# Altium schematic sheet Sheet1.SchDoc: Network Analyzer
size A
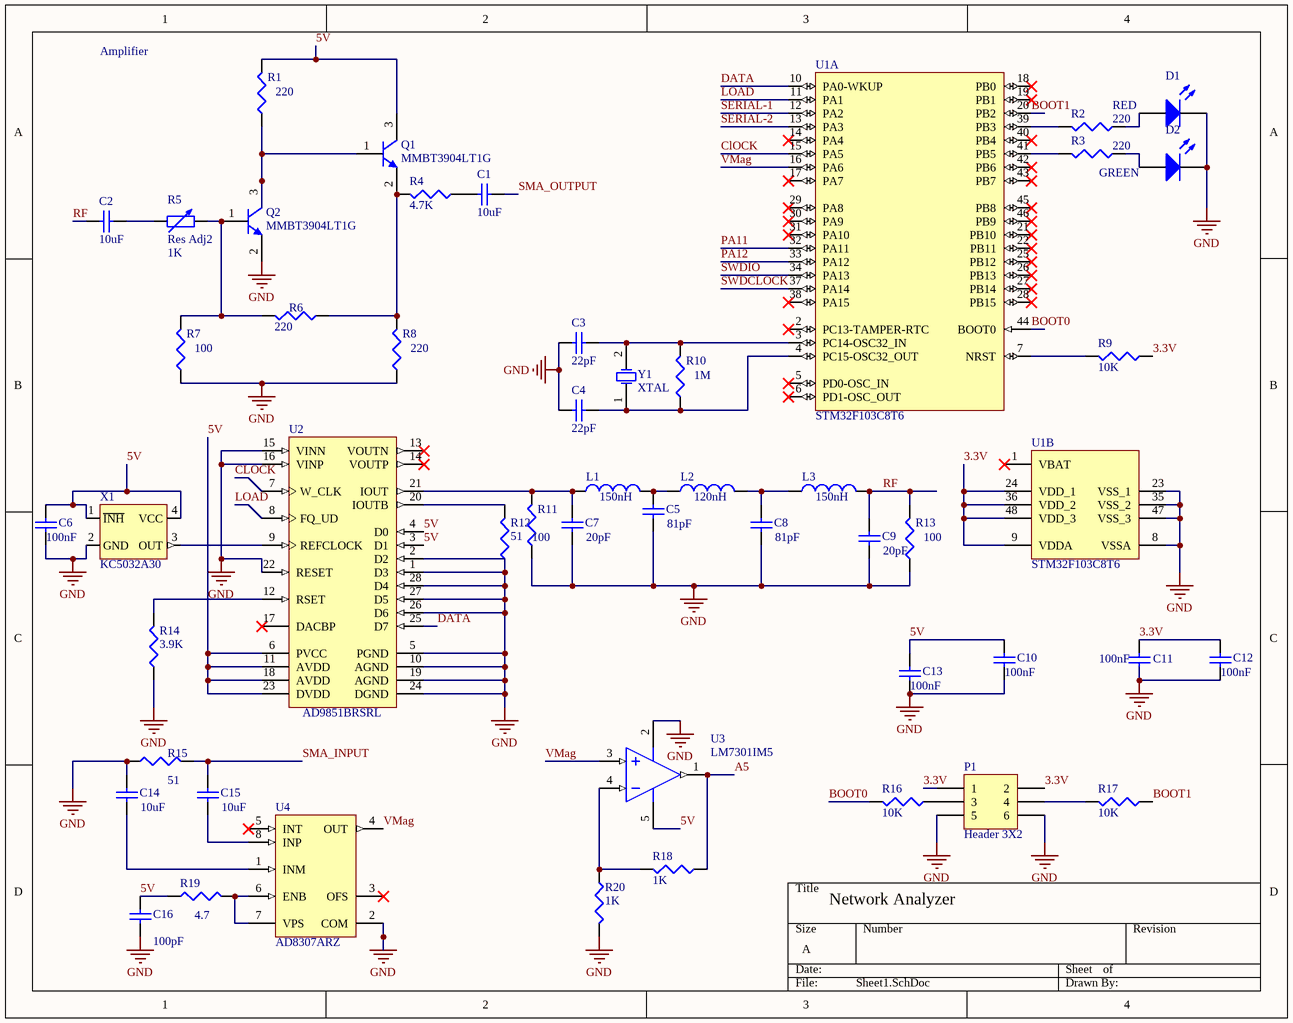
[diagram p0: Sheet1.SchDoc]

## Parts
C1  value 10uF  [CAP 0603/1608]  (hidden comment: Cap Semi)
C2  value 10uF  [CAP 0603/1608]  (hidden comment: Cap Semi)
C3  value 22pF  [CAP 0603/1608]  (hidden comment: Cap Semi)
C4  value 22pF  [CAP 0603/1608]  (hidden comment: Cap Semi)
C5  value 81pF  [CAP 0603/1608]  (hidden comment: Cap Semi)
C6  value 100nF  [CAP 0603/1608]  (hidden comment: Cap Semi)
C7  value 20pF  [CAP 0603/1608]  (hidden comment: Cap Semi)
C8  value 81pF  [CAP 0603/1608]  (hidden comment: Cap Semi)
C9  value 20pF  [CAP 0603/1608]  (hidden comment: Cap Semi)
C10  value 100nF  [1608[0603]]  (hidden comment: Cap Semi)
C11  value 100nF  [1608[0603]]  (hidden comment: Cap Semi)
C12  value 100nF  [1608[0603]]  (hidden comment: Cap Semi)
C13  value 100nF  [1608[0603]]  (hidden comment: Cap Semi)
C14  value 10uF  [1608[0603]]  (hidden comment: Cap Semi)
C15  value 10uF  [1608[0603]]  (hidden comment: Cap Semi)
C16  value 100pF  [1608[0603]]  (hidden comment: Cap Semi)
D1  RED  [LED 0603/1608 RED]
D2  GREEN  [LED 0603/1608 GREEN]
L1  value 150nH  [RES 0805/2012]  (hidden comment: Inductor)
L2  value 120nH  [RES 0603/1608]  (hidden comment: Inductor)
L3  value 150nH  [RES 0805/2012]  (hidden comment: Inductor)
P1  Header 3X2  [HDR2X3]
Q1  MMBT3904LT1G  [ONSC-SOT-23-3-318-08_V]
Q2  MMBT3904LT1G  [ONSC-SOT-23-3-318-08_V]
R1  value 220  [RES 0603/1608]  (hidden comment: Res3)
R2  value 220  [RES 0603/1608]  (hidden comment: Res3)
R3  value 220  [RES 0603/1608]  (hidden comment: Res3)
R4  value 4.7K  [RES 1206/3216]  (hidden comment: Res3)
R5  Res Adj2  value 1K  [POT BOURNS TRIMPOT 3302]
R6  value 220  [RES 0603/1608]  (hidden comment: Res3)
R7  value 100  [RES 0603/1608]  (hidden comment: Res3)
R8  value 220  [RES 0603/1608]  (hidden comment: Res3)
R9  value 10K  [RES 0603/1608]  (hidden comment: Res3)
R10  value 1M  [RES 0603/1608]  (hidden comment: Res3)
R11  value 100  [RES 0603/1608]  (hidden comment: Res3)
R12  value 51  [RES 0603/1608]  (hidden comment: Res3)
R13  value 100  [RES 0603/1608]  (hidden comment: Res3)
R14  value 3.9K  [RES 0603/1608]  (hidden comment: Res3)
R15  value 51  [J1-0603]  (hidden comment: Res3)
R16  value 10K  [J1-0603]  (hidden comment: Res3)
R17  value 10K  [J1-0603]  (hidden comment: Res3)
R18  value 1K  [J1-0603]  (hidden comment: Res3)
R19  value 4.7  [J1-0603]  (hidden comment: Res3)
R20  value 1K  [J1-0603]  (hidden comment: Res3)
U1  STM32F103C8T6  [STM-LQFP48_N]  (parts A,B of 2)
U2  AD9851BRSRL  [ADI-RS-28_M]
U3  LM7301IM5  [MF05A_N]
U4  AD8307ARZ  [ADI-R-8_N]
X1  KC5032A30  [KC5032A30]
Y1  XTAL  [ABRACON ABLS]

## Nets
GND: C3.2 C4.2 C5.1 C6.1 C7.1 C8.1 C9.1 C10.1 C11.1 C12.1 C13.1 C14.2 C16.1 D1.2(K) D2.2(K) P1.5 P1.6 Q2.2(E) R7.1 R8.1 R11.1 R12.1 R13.1 R14.1 R15.1 R20.2 U1.8(VSSA) U1.23(VSS_1) U1.35(VSS_2) U1.47(VSS_3) U2.1(D3) U2.2(D2) U2.5(PGND) U2.10(AGND) U2.15(VINN) U2.16(VINP) U2.19(AGND) U2.22(RESET) U2.24(DGND) U2.26(D6) U2.27(D5) U2.28(D4) U3.2(V-) U4.2(COM) X1.2(GND)
3.3V: C11.2 C12.2 P1.1 P1.2 R9.1 U1.9(VDDA) U1.24(VDD_1) U1.36(VDD_2) U1.48(VDD_3)
5V: C6.2 C10.2 C13.2 C16.2 Q1.3(C) R1.2 R19.1 U2.3(D1) U2.4(D0) U2.6(PVCC) U2.11(AVDD) U2.18(AVDD) U2.23(DVDD) U3.5(V+) X1.1(~{INH}) X1.4(VCC)
A5: R18.1 U3.1(OUT)
BOOT0: R16.2 U1.44(BOOT0)
BOOT1: R17.1 U1.20(PB2)
CLOCK: U1.15(PA5) U2.7(W_CLK)
DATA: U1.10(PA0-WKUP) U2.25(D7)
LOAD: U1.11(PA1) U2.8(FQ_UD)
PA11: U1.32(PA11)
PA12: U1.33(PA12)
RF: C2.2 C9.2 L3.2 R13.2
SERIAL-1: U1.12(PA2)
SERIAL-2: U1.13(PA3)
SMA_INPUT: C15.2 R15.2
SMA_OUTPUT: C1.2
SWDCLOCK: U1.37(PA14)
SWDIO: U1.34(PA13)
VMag: U1.16(PA6) U3.3(IN+) U4.4(OUT)
NetC1_1: C1.1 R4.1
NetC2_1: C2.1 R5.1
NetC3_1: C3.1 R10.2 U1.3(PC14-OSC32_IN) Y1.2(OSC2)
NetC4_1: C4.1 R10.1 U1.4(PC15-OSC32_OUT) Y1.1(OSC1)
NetC5_2: C5.2 L1.2 L2.1
NetC7_2: C7.2 L1.1 R11.2 U2.21(IOUT)
NetC8_2: C8.2 L2.2 L3.1
NetC14_1: C14.1 U4.1(INM)
NetC15_1: C15.1 U4.8(INP)
NetD1_1: D1.1(A) R2.1
NetD2_1: D2.1(A) R3.1
NetP1_3: P1.3 R16.1
NetP1_4: P1.4 R17.2
NetQ1_1: Q1.1(B) Q2.3(C) R1.1
NetQ1_2: Q1.2(E) R4.2 R6.1 R8.2
NetQ2_1: Q2.1(B) R5.2 R6.2 R7.2
NetR2_2: R2.2 U1.39(PB3)
NetR3_2: R3.2 U1.41(PB5)
NetR9_2: R9.2 U1.7(NRST)
NetR12_2: R12.2 U2.20(IOUTB)
NetR14_2: R14.2 U2.12(RSET)
NetR18_2: R18.2 R20.1 U3.4(IN-)
NetR19_2: R19.2 U4.6(ENB) U4.7(VPS)
NetU2_9: U2.9(REFCLOCK) X1.3(OUT)

Not connected (* = marked no-connect by the designer): U1 1(VBAT)* 2(PC13-TAMPER-RTC)* 5(PD0-OSC_IN)* 6(PD1-OSC_OUT)* 14(PA4)* 17(PA7)* 18(PB0)* 19(PB1)* 21(PB10)* 22(PB11)* 25(PB12)* 26(PB13)* 27(PB14)* 28(PB15)* 29(PA8)* 30(PA9)* 31(PA10)* 38(PA15)* 40(PB4)* 42(PB6)* 43(PB7)* 45(PB8)* 46(PB9)*; U2 13(VOUTN)* 14(VOUTP)* 17(DACBP)*; U4 3(OFS)* 5(INT)*

## Notes on the sheet
- Amplifier
- Network Analyzer

## Library data of the parts
C1-C16 = Cap Semi: Capacitor (Semiconductor SIM Model); Published: 8-Jun-2000; LatestRevisionDate: 29-May-2009; LatestRevisionNote: IPC-7351 Footprint Added.; PackageReference: C1206; Publisher: Altium Limited; PackageDescription: Chip Capacitor
D1 D2 = LED3: Typical BLUE SiC LED; Published: 8-Jun-2000; LatestRevisionDate: 17-Dec-2003; LatestRevisionNote: PCB Footprint replaced.; DatasheetVersion: 16-Apr-2002; PackageVersion: 16-Apr-2002; PackageReference: 3.5X2.8X1.9; Publisher: Altium Limited; PackageDescription: SM LED; 2 C-Bend Leads; Body 3.5 x 2.8 x 1.9 mm, inc leads (LxWxH typ)
L1-L3 = Inductor: Code_IEC: 1005; Published: 8-Jun-2000; LatestRevisionDate: 29-May-2009; LatestRevisionNote: IPC-7351 Footprint Added.; PackageReference: 0402-A; Publisher: Altium Limited; PackageDescription: Chip Inductor; Code_JEITA: 0402
P1 = Header 3X2: Header, 3-Pin, Dual row; LatestRevisionDate: 17-Jul-2002; LatestRevisionNote: Re-released for DXP Platform.; Publisher: Altium Limited
Q1 Q2 = MMBT3904LT1G: General Purpose Transistor, NPN Silicon, 3-Pin SOT-23, Pb-Free, Tape and Reel; Manufacturer: On Semiconductor; fT Min (MHz): 300; IC Continuous (A): 0.2; DatasheetVersion: Rev. 12; PackageVersion: Rev. AP, 11/2009; PackageReference: SOT-23-3-318-08; PackageDescription: 3-Pin Small Outline Transistor, Body 2.92 x 1.3 mm, Pitch 0.95 mm; Supplier 1: Digi-Key; Supplier Part Number 1: MMBT3904LT1GOSTR-ND; Supplier 2: Digi-Key; Supplier Part Number 2: MMBT3904LT1GOSCT-ND; Supplier 3: Digi-Key; Supplier Part Number 3: MMBT3904LT1GOSDKR-ND; Supplier 4: Farnell; Supplier Part Number 4: 2317804; Supplier 5: Farnell; Supplier Part Number 5: 1459100; Supplier 6: Farnell; Supplier Part Number 6: 1459100RL; Supplier 7: Newark; Supplier Part Number 7: 83K0942; Supplier 8: Newark; Supplier Part Number 8: 83H7337; Supplier 9: Newark; Supplier Part Number 9: 28X7922; Supplier 10: Mouser; Supplier Part Number 10: 863-MMBT3904LT1G; Packing: Tape and Reel; Polarity: NPN; RoHS: TRUE; Mounting Technology: Surface Mount; PartNumber: MMBT3904LT1G; ComponentLink1Description: Manufacturer URL; ComponentLink1URL: http://www.onsemi.com/; ComponentLink2Description: Datasheet; ComponentLink2URL: http://www.onsemi.cn/pub_link/Collateral/MMBT3904LT1-D.PDF; ComponentLink3Description: Package Specification; ComponentLink3URL: http://www.onsemi.cn/pub_link/Collateral/318-08.PDF
R1-R4 R6-R20 = Res3: Resistor; Published: 8-Jun-2000; LatestRevisionDate: 29-May-2009; LatestRevisionNote: IPC-7351 Footprint Added.; PackageReference: J1-0603; Publisher: Altium Limited; PackageDescription: Chip Resistor
R5 = Res Adj2: Variable Resistor; Set Position: 0.5; Published: 8-Jun-2000; LatestRevisionDate: 17-Jul-2002; LatestRevisionNote: Re-released for DXP Platform.; PackageReference: AXIAL-0.6; Publisher: Altium Limited; PackageDescription: Axial Device, Thru-Hole; 2 Leads; 0.6 in Pin Spacing
U1 = STM32F103C8T6: ARM Cortex-M3 32-bit MCU, 64 KB Flash, 20 KB Internal RAM, 37 I/Os, 48-pin LQFP, -40 to 85 degC, Tray; A/D Converter: 2x12-bit (10 Channel); FLASH Size (Prog) (kB): 64; I/Os (High Current): 37; Internal RAM Size (kB): 20; Operating Frequency(F) (Processor speed) (MHz): 72; Supply Voltage(Vcc) min (V): 2; DatasheetVersion: Rev. 16; PackageVersion: Rev. 6, 06/2013; PackageReference: LQFP48; PackageDescription: 48-Pin Low Profile Quad Flat Package, 7 x 7 mm Body, 0.5 mm Pitch; Supplier 1: Digi-Key; Supplier Part Number 1: 497-6063-ND; Supplier 2: Farnell; Supplier Part Number 2: 1447637; Supplier 3: Newark; Supplier Part Number 3: 59M2182; Supplier 4: Newark; Supplier Part Number 4: 57P1222; Supplier 5: Mouser; Supplier Part Number 5: 511-STM32F103C8T6; Core: ARM Cortex-M3; Packing: Tray; Mounting Technology: Surface Mount; PartNumber: STM32F103C8T6; ComponentLink1Description: Manufacturer URL; ComponentLink1URL: http://www.st.com/web/en/home.html; ComponentLink2Description: Datasheet; ComponentLink2URL: http://www.st.com/st-web-ui/static/active/en/resource/technical/document/datasheet/CD00161566.pdf; ComponentLink3Description: Package Specification; ComponentLink3URL: http://www.st.com/st-web-ui/static/active/en/resource/technical/document/datasheet/DM00058181.pdf
U2 = AD9851BRSRL: CMOS 180 MHz DDS/DAC Synthesizer, 10-Bit, Parallel, Serial, RS-28, 1500 Reel,Pb-Free; Master fclk: 180MHz; Resolution (Bits): 10bit; Tuning Word Width (bits): 32bit; REFCLK Multiplier: Yes; Compliance Range (V): 1.5V; FS Iout (mA nom): 20mA; I Supply total (max): 130mA; DatasheetVersion: Rev. D; PackageVersion: revA, 1997; PackageReference: RS-28; PackageDescription: 28-Lead Shrink Small Outline Package [SSOP]; I/O Interface: Parallel, Serial; Code_JEDEC: MO-150-AH; ComponentLink1Description: Manufacturer URL; ComponentLink1URL: www.analog.com; ComponentLink2Description: Datasheet; ComponentLink2URL: http://www.analog.com/static/imported-files/data_sheets/AD9851.pdf; ComponentLink3Description: Package Specification; ComponentLink3URL: http://www.analog.com/static/imported-files/packages/32122249223724RS_28.pdf
U3 = LM7301IM5: Low Power, 4 MHz GBW, Rail-to-Rail Input-Output Operational Amplifier, 5-pin SOT-23; Manufacturer: National Semiconductor; PackageTopMarking: A04A*XTT; PowerWise: N; CompType: Amplifiers; High-Reliability: Y; DatasheetVersion: May-2009; PackageVersion: revD, Aug-2008; PackageReference: MF05A; PackageDescription: Molded SOT-23, .115 x .063 x .040 in Body, 5 Lead, .0375 in Pitch; PartNumber: LM7301IM5; RoHS: N; PinCount: 5; ComponentLink1Description: Manufacturer URL; ComponentLink1URL: http://www.national.com/; ComponentLink2Description: LM7301 Datasheet; ComponentLink2URL: http://www.national.com/ds/LM/LM7301.pdf; ComponentLink3Description: LM7301 Web Page; ComponentLink3URL: http://www.national.com/pf/LM/LM7301.html; ComponentLink4Description: MF05A Package Page; ComponentLink4URL: http://www.national.com/packaging/folders/mf05a.html
U4 = AD8307ARZ: Low Cost, DC to 500 MHz, 92 dB Logarithmic Amplifier, 400ns Response Time, R-8, Pb-Free, 98 Tube; Product Description: High Dynamic Range; Dynamic Range (dB): 92dB; Temp Stability (dB): 1dB; Voltage Supply (V): 2.7 to 5.5; Supply Current: 8mA; DatasheetVersion: Rev. D; PackageVersion: 060506-A; PackageReference: R-8; PackageDescription: 8-Lead Standard Small Outline Package [SOIC_N]; RF Frequency (MHz): dc to 500; Response Time (ns typ): 400ns; Code_JEDEC: MS-012-AA; ComponentLink1Description: Manufacturer URL; ComponentLink1URL: www.analog.com; ComponentLink2Description: Datasheet; ComponentLink2URL: http://www.analog.com/static/imported-files/data_sheets/AD8307.pdf; ComponentLink3Description: Package Specification; ComponentLink3URL: http://www.analog.com/static/imported-files/packages/PKG_PDF/SOIC_Narrow%20(R)/R_8.pdf
X1 = KC5032A30: Standard Clock Oscillators 30.0000MHZ; Mfr1: AVX / Kyocera; Mfr PN: KC5032A30
Y1 = XTAL: Crystal Oscillator; Published: 8-Jun-2000; LatestRevisionDate: 17-Jul-2002; LatestRevisionNote: Re-released for DXP Platform.; PackageReference: R38; Publisher: Altium Limited; PackageDescription: Crystal, Thru-Hole; 2 Leads; Body 3.1 x 8.2 mm (Dia.xH)